# EAGLE design Rov3_zasilanie (EAGLE 9.4.0)
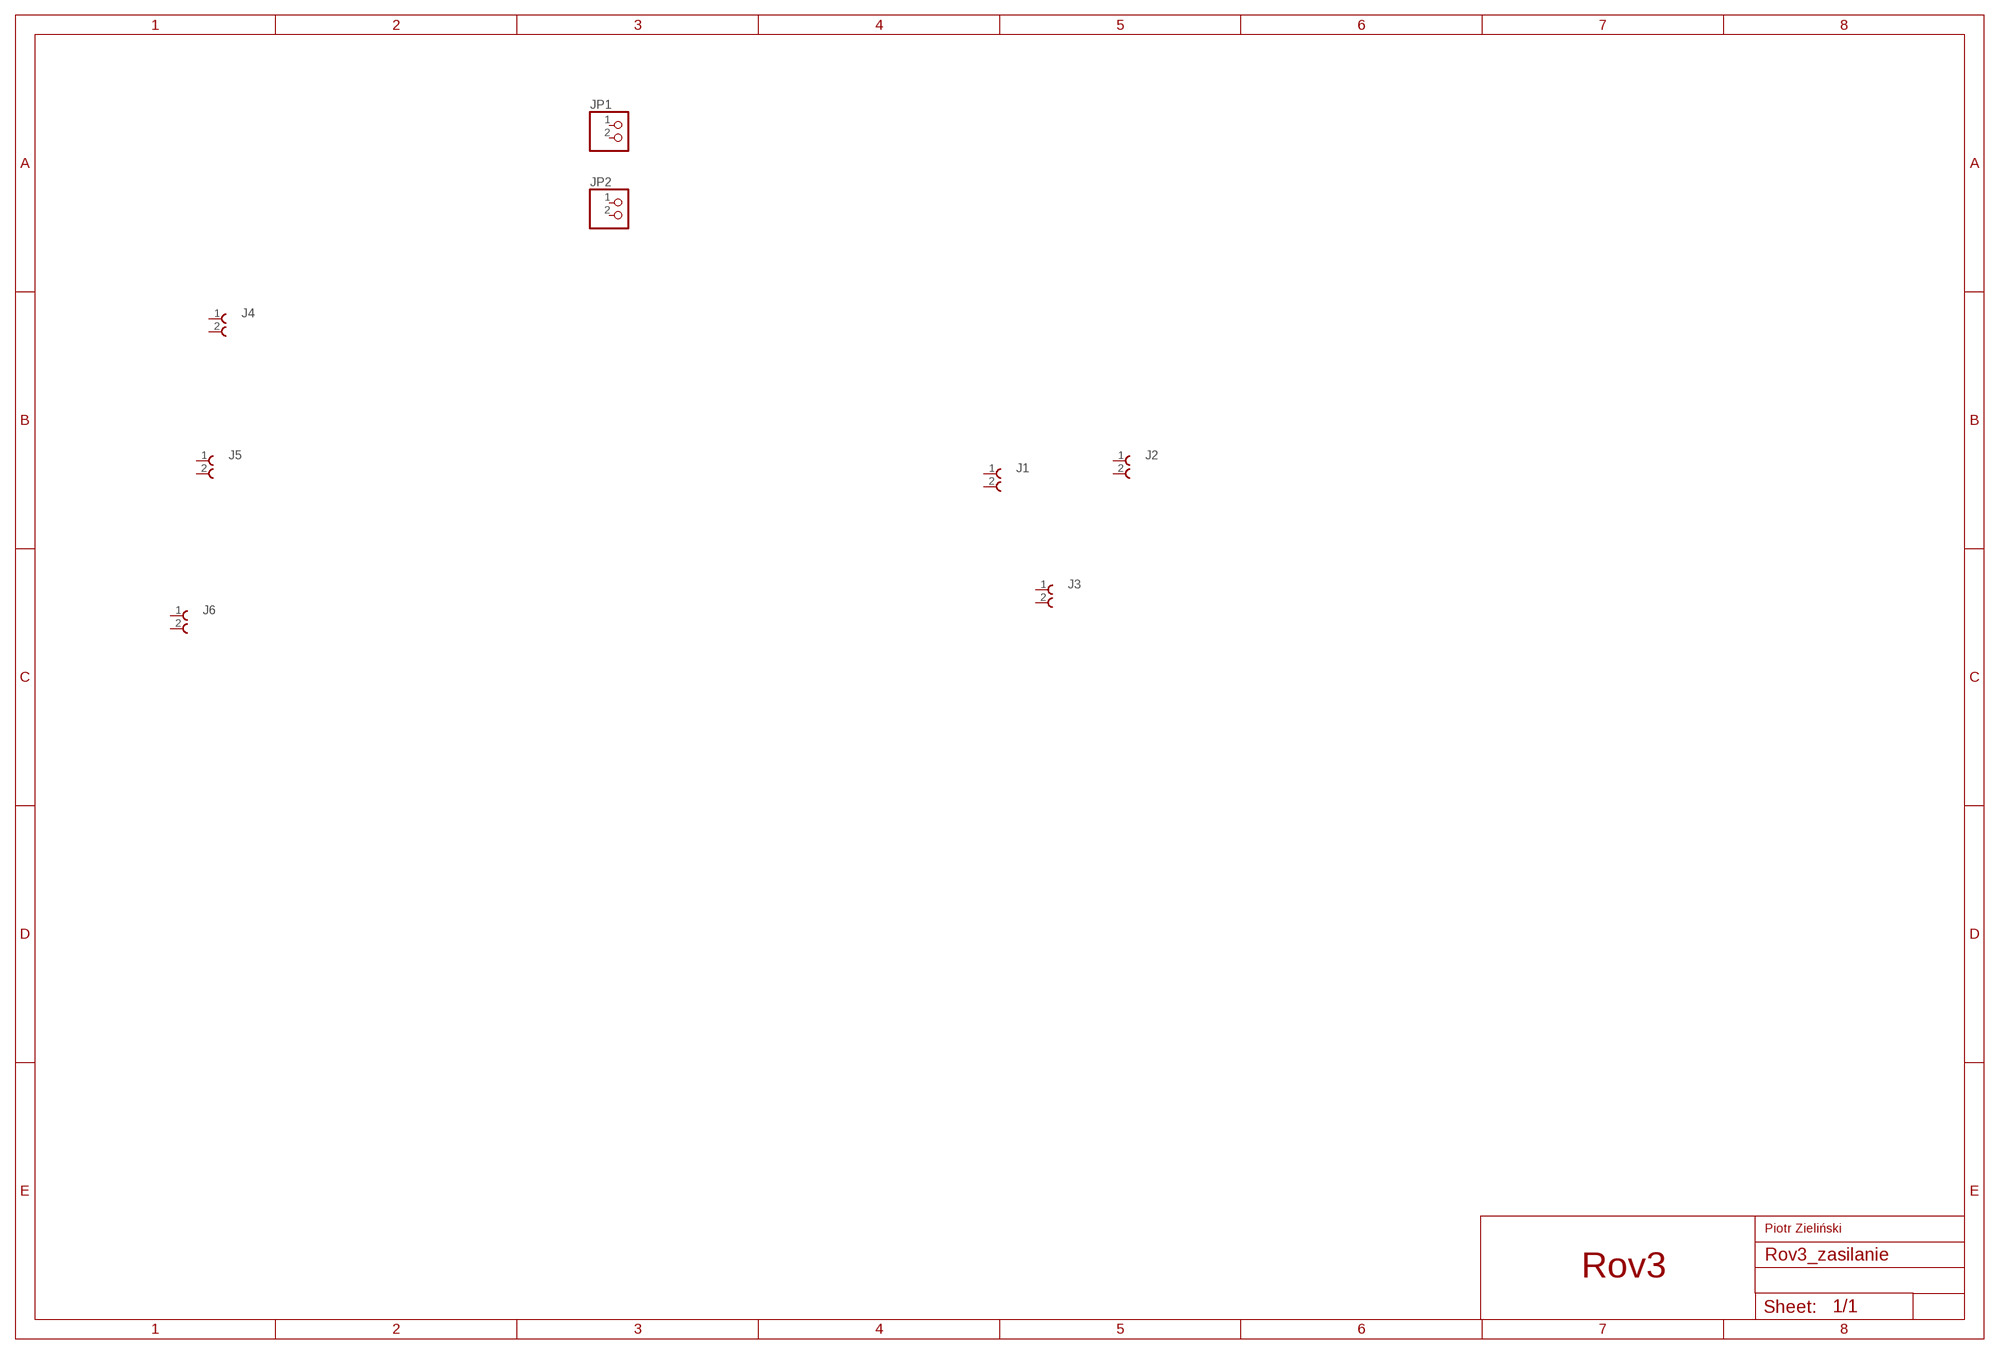
[diagram p0: schematic, sheet 1]

## Parts
J1  691241710002  [691241710002]
J2  691241710002  [691241710002]
J3  691241710002  [691241710002]
J4  691216510002  [691216510002]
J5  691216510002  [691216510002]
J6  691216510002  [691216510002]
JP1  PINHD-1X2  [1X02]
JP2  PINHD-1X2  [1X02]
Unconnected: J1.1 J1.2 J2.1 J2.2 J3.1 J3.2 J4.1 J4.2 J5.1 J5.2 J6.1 J6.2 JP1.1 JP1.2 JP2.1 JP2.2

## Notes on the sheet
- Piotr Zieliński
- Rov3

## Library data of the parts
J1-J3 = Wurth_Elektronik_Electromechanic_Terminal_Blocks_Connectors_rev19a:691241710002: SERIE 2417 - 5.00 MM - HORIZONTAL CABLE ENTRY WITH RISING CAGE CLAMP - WR-TBL =>ConTBL2 691241710002 Characteristics INSULATOR:PA6/66 FLAMABILITY RATING: UL94V0 COLOR: GREEN METAL HOUSING: COPPER ALLOY / Ni+Sn TERMINAL SCREW: STEEL / Zn WIRE GUARD: COPPER ALLOY / Ni+Sn FLANGES NUT: BRASS M2.5 OPERATING TEMPERATURE:-30°C UP TO +120°C COMPLIANCE: LEAD FREE AND ROHS ELECTRICAL UL VDE CURRENT RATING: 14A 14A WORKING VOLTAGE: 300VAC 250VAC WITHSTANDING VOLTAGE: 1,6KV 2KV CONTACT RESISTANCE: 20 mOhm max <http://katalog.we-online.de/media/images/v2/Family_WR-TBL_5_00_2417_HORIZONTAL_CABLE_ENTRY_6912417100XX.jpg> Details see: http://katalog.we-online.de/en/em/TBL_5_00_2417_HORIZONTAL_CABLE_ENTRY_W_RISING_CLAMP_6912417100XX 2015 (C) Wurth Elektronik
J4-J6 = Wurth_Elektronik_Electromechanic_Terminal_Blocks_Connectors_rev19a:691216510002: WR-TBL Serie 2165 - 5.08mm Horizontal Entry Modular with Rising Cage Clamp - 3.5mm2 Wires, 2 Pins=>Code : Con_TBL_Screw_RisingClamp_5.08_691216510002 Created 2014-06-18, Karrer Zheng 2014 (C) Würth Elektronik
JP1 JP2 = pinhead:PINHD-1X2: PIN HEADER

## Board
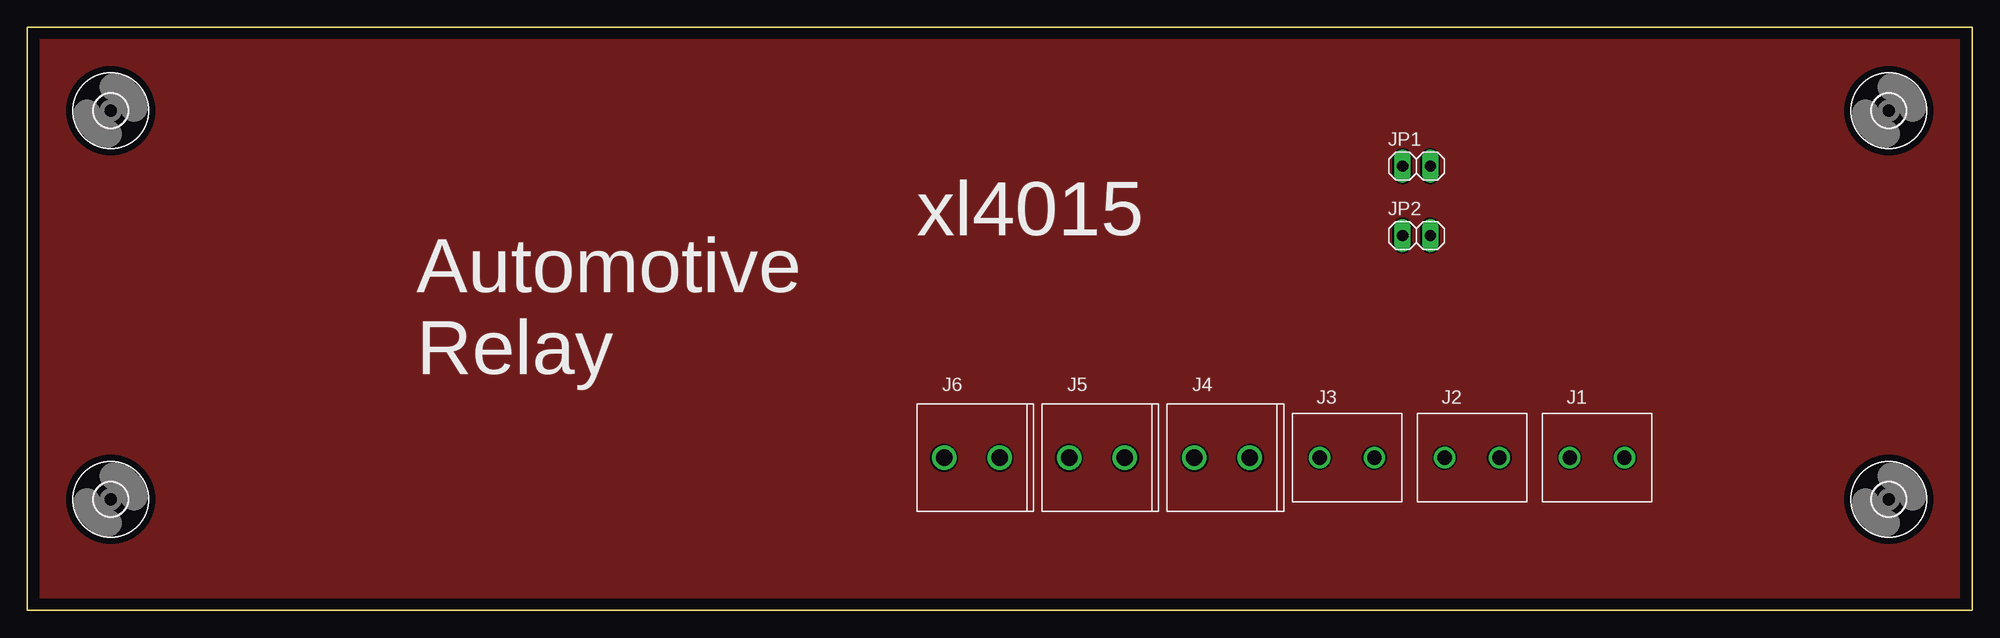
[diagram p1: board, top side]

Size 177.8 x 53.34 mm. Coordinates in mm from the lower left corner, seen from the top.
Outline: 0,0 177.8,0 177.8,53.34 0,53.34 0,0
Copper layers (1*16): Top 0.035mm / dielectric 1.5mm / Bottom 0.035mm
Design rules "default": minimum track width 6mil, minimum drill 0.35mm, track to track 6mil, track to pad 6mil, pad to pad 6mil, via to via 6mil, smd to smd 6mil, copper to edge 40mil, drill to drill 6mil, minimum pad ring 10mil, minimum via ring 8mil, stop-mask expansion 4mil, vias tented up to drill 0mil, thermal gap 10mil

### Footprints (pad centres in the part's own frame; a part is rotated, then mirrored left to right if it is on the bottom)
691241710002 = drill 1.3: 1 -2.5,0; 2 2.5,0
691216510002 = drill 1.5: 1 -2.54,0; 2 2.54,0
1X02 = drill 1.016 long: 1 -1.27,0; 2 1.27,0
3,0 = hole 3: 0,0

### Placement (x,y rotation side)
J1  143.51,13.97 0 top
J2  132.08,13.97 0 top
J3  120.65,13.97 0 top
J4  109.22,13.97 0 top
J5  97.79,13.97 0 top
J6  86.36,13.97 0 top
JP1  127,40.64 0 top
JP2  127,34.29 0 top
U$1  [3,0]  7.62,10.16 0 top
U$2  [3,0]  7.62,45.72 0 top
U$3  [3,0]  170.18,45.72 0 top
U$4  [3,0]  170.18,10.16 0 top

### Tracks (layer width: path | path; a pad name or v marks a point on that pad's centre or on a via)
GND
  pour Top: 0,0 177.8,0 177.8,53.34 0,53.34

### Text on the board
tNames: xl4015 | Automotive / Relay
tDocu: xt-60? | xt-60?